# Altium schematic sheet ConectoresEntrada.SchDoc
size 355 x 254 mm; DrawnBy: Constanza Barriga
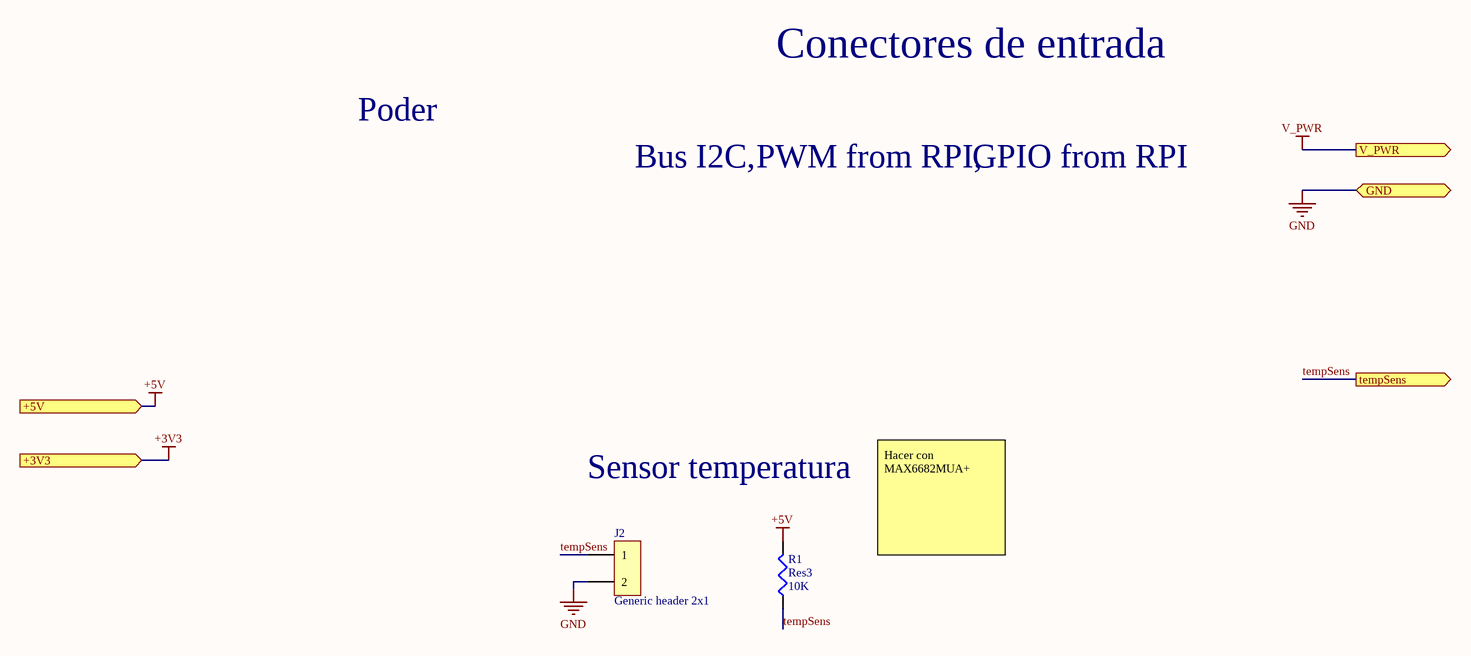
[diagram p0: ConectoresEntrada.SchDoc]

## Parts
J2  Generic header 2x1  [CONN-TH_A2547WV-2P]
R1  Res3  value 10K  [J1-0603]

## Ports
+3V3 (in), +5V (in), GND (bidir), tempSens (out), V_PWR (out)

## Nets
+3V3: port +3V3
+5V: R1.2 ; port +5V
GND: J2.2 ; port GND
V_PWR: port V_PWR
tempSens: J2.1 R1.1 ; port tempSens

## Notes on the sheet
- Conectores de entrada
- Poder
- Bus I2C,
- PWM from RPI,
- GPIO from RPI
- Sensor temperatura
- Hacer con MAX6682MUA+

## Library data of the parts
J2 = Header - 2x1: Generic Header 2pos, 1 row, 2.54 pitch; Manufacturer: CJT(Changjiang Connectors); Manufacturer Part Number: A2547WV-2P; Pitch: 2.54mm; Supplier 1: LCSC; Supplier Part Number 1: C239377; Package: Through Hole,P=2.54mm
R1 = Res3: Resistor; Manufacturer: PANASONIC; Manufacturer Part Number: ERJPA3F1002V; Published: 8-Jun-2000; LatestRevisionDate: 29-May-2009; LatestRevisionNote: IPC-7351 Footprint Added.; PackageReference: J1-0603; Publisher: Altium Limited; PackageDescription: Chip Resistor; Supplier 1: LCSC; Supplier Part Number 1: C441927